# Altium schematic sheet main.SchDoc
size 149 x 100 mm; SheetNumber: 3; SheetTotal: 5
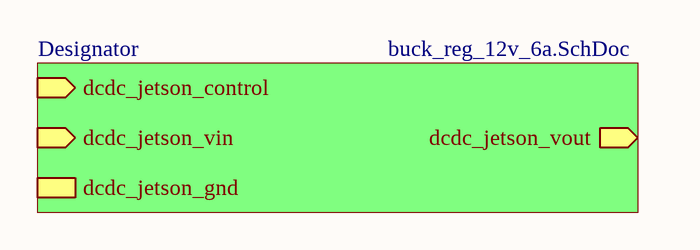
[diagram p0: main.SchDoc]

## Sub-sheets
Designator = buck_reg_12v_6a.SchDoc: dcdc_jetson_control (in), dcdc_jetson_vin (in), dcdc_jetson_gnd, dcdc_jetson_vout (out)